# EAGLE design motor (EAGLE 6.6.0)
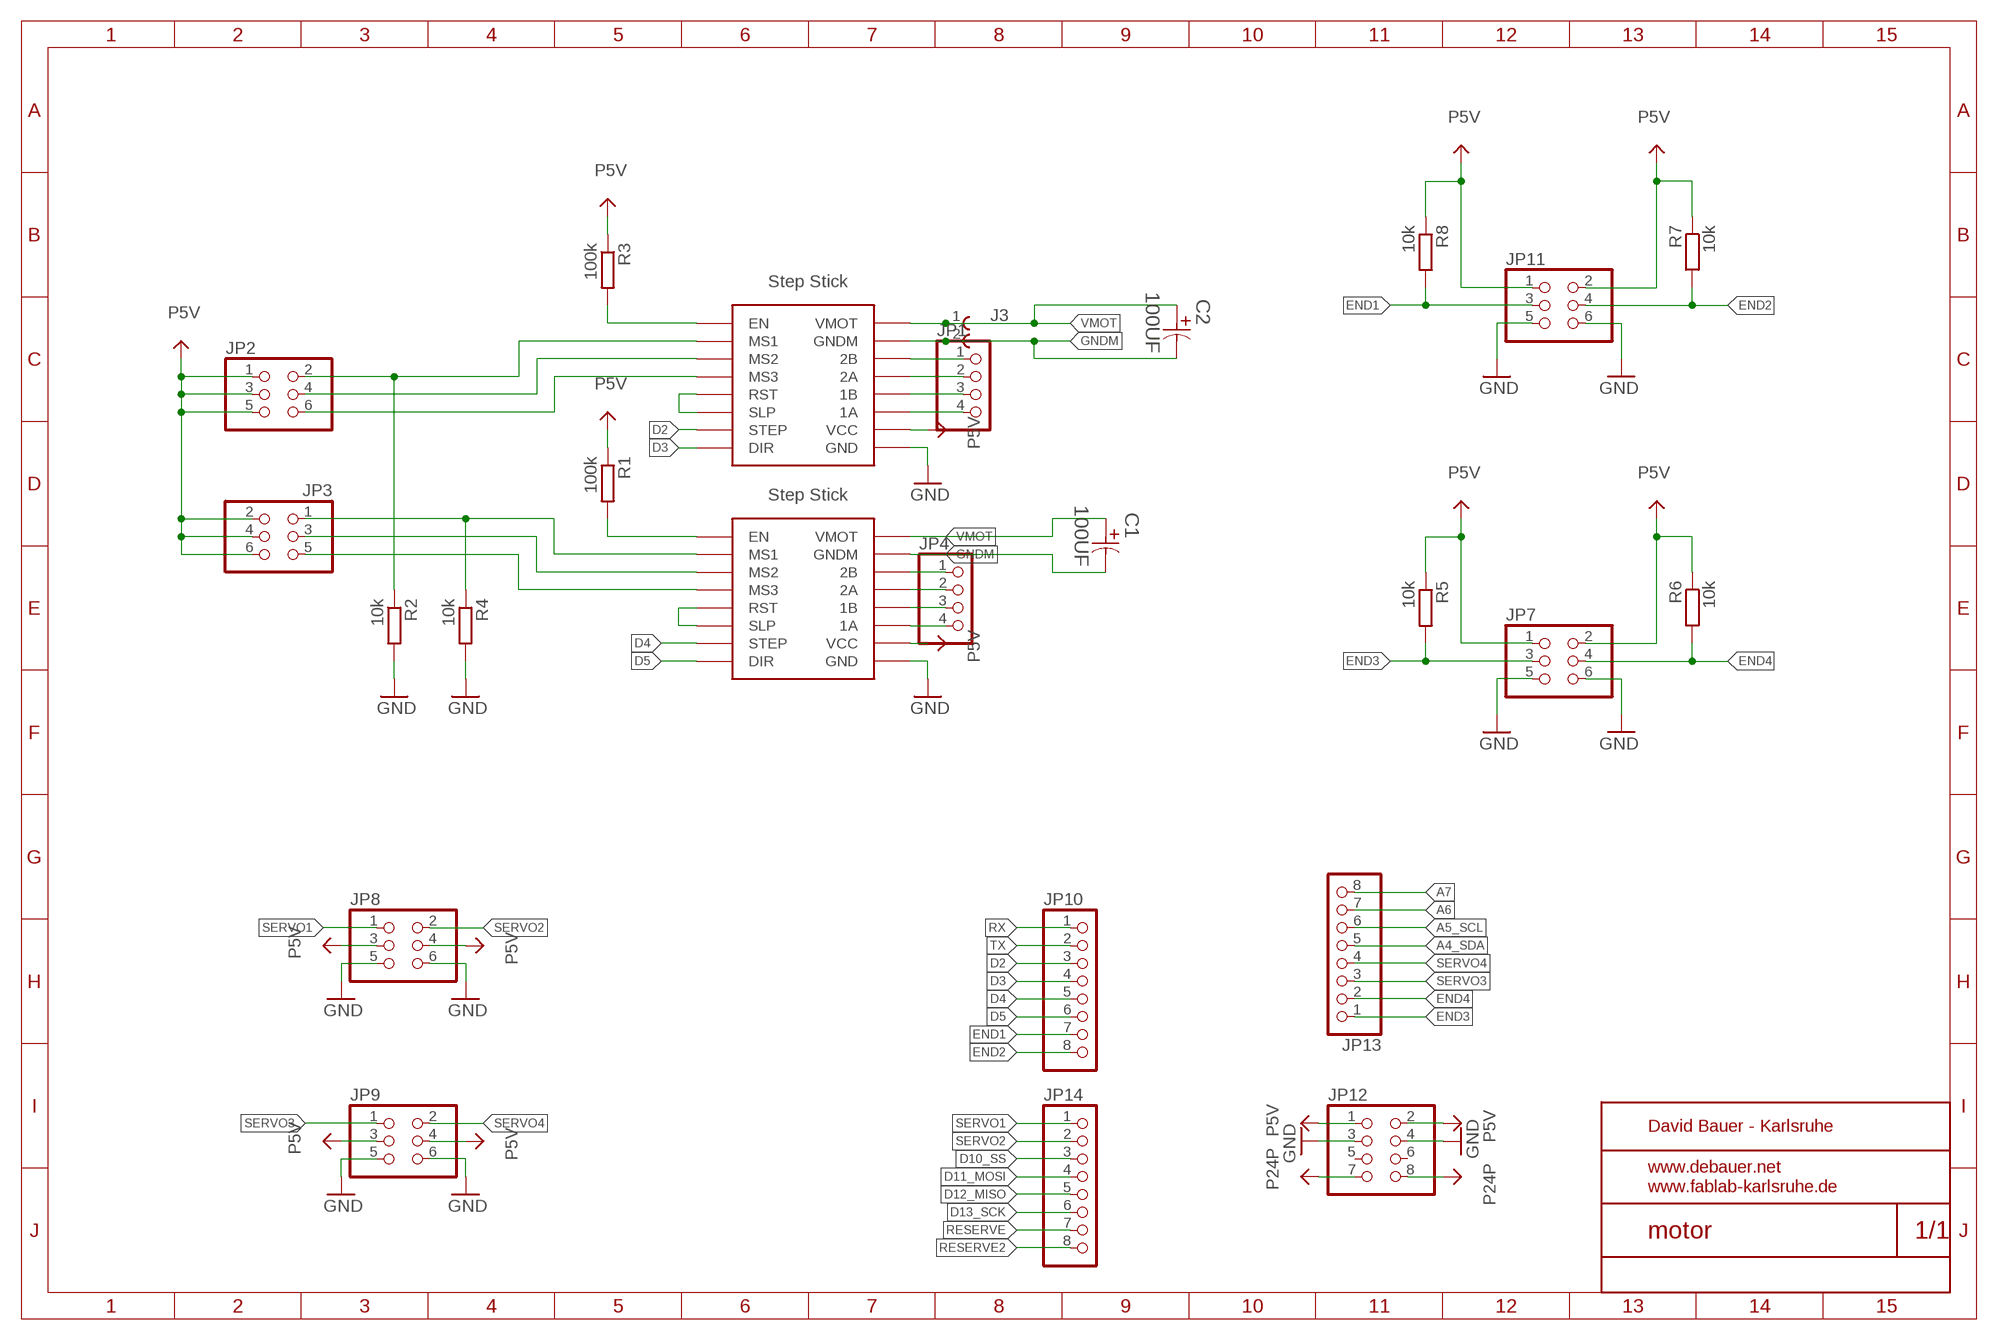
[diagram p0: schematic, sheet 1]

## Parts
C1  100UF  EEE-FK1V101P-CASE-F  [CAPAE830X1050N]
C2  100UF  EEE-FK1V101P-CASE-F  [CAPAE830X1050N]
J3  691312510002  [691312510002]
JP1  PINHD-1X4/90  [1X04/90]
JP2  PINHD-2X3  [2X03]
JP3  PINHD-2X3  [2X03]
JP4  PINHD-1X4/90  [1X04/90]
JP7  PINHD-2X3/90  [2X03/90]
JP8  PINHD-2X3/90  [2X03/90]
JP9  PINHD-2X3/90  [2X03/90]
JP10  PINHD-1X8  [1X08]
JP11  PINHD-2X3/90  [2X03/90]
JP12  PINHD-2X4  [2X04]
JP13  PINHD-1X8  [1X08]
JP14  PINHD-1X8  [1X08]
R1  100k  R-EU_R0805  [R0805]
R2  10k  R-EU_R0805  [R0805]
R3  100k  R-EU_R0805  [R0805]
R4  10k  R-EU_R0805  [R0805]
R5  10k  R-EU_R0805  [R0805]
R6  10k  R-EU_R0805  [R0805]
R7  10k  R-EU_R0805  [R0805]
R8  10k  R-EU_R0805  [R0805]
U$1  STEP-STICK  [STEP-STICK]
U$2  STEP-STICK  [STEP-STICK]

## Nets
A4_SDA: JP13.5
A5_SCL: JP13.6
A6: JP13.7
A7: JP13.8
D2: JP10.3 U$2.SPT(STEP)
D3: JP10.4 U$2.DIR
D4: JP10.5 U$1.SPT(STEP)
D5: JP10.6 U$1.DIR
D10_SS: JP14.3
D11_MOSI: JP14.4
D12_MISO: JP14.5
D13_SCK: JP14.6
END1: JP10.7 JP11.3 R8.2
END2: JP10.8 JP11.4 R7.2
END3: JP7.3 JP13.1 R5.2
END4: JP7.4 JP13.2 R6.2
GND: JP7.5 JP7.6 JP8.5 JP8.6 JP9.5 JP9.6 JP11.5 JP11.6 JP12.3 JP12.4 R2.2 R4.2 U$1.GND U$2.GND
GNDM: C1.2 C2.2 J3.2 U$1.GNDM U$2.GNDM
N$1: JP2.2 R2.1 U$2.MS1
N$2: JP2.4 U$2.MS2
N$3: JP2.6 U$2.MS3
N$4: JP3.1 R4.1 U$1.MS1
N$5: JP3.3 U$1.MS2
N$6: JP3.5 U$1.MS3
N$7: R1.2 U$1.EN
N$8: U$2.RST U$2.SLP
N$9: R3.2 U$2.EN
N$10: U$1.RST U$1.SLP
N$11: JP1.4 U$2.1A
N$12: JP1.3 U$2.1B
N$13: JP1.2 U$2.2A
N$14: JP1.1 U$2.2B
N$15: JP4.1 U$1.2B
N$16: JP4.2 U$1.2A
N$17: JP4.3 U$1.1B
N$18: JP4.4 U$1.1A
P5V: JP2.1 JP2.3 JP2.5 JP3.2 JP3.4 JP3.6 JP7.1 JP7.2 JP8.3 JP8.4 JP9.3 JP9.4 JP11.1 JP11.2 JP12.1 JP12.2 R1.1 R3.1 R5.1 R6.1 R7.1 R8.1 U$1.VCC U$2.VCC
P24P: JP12.7 JP12.8
RESERVE: JP14.7
RESERVE2: JP14.8
RX: JP10.1
SERVO1: JP8.1 JP14.1
SERVO2: JP8.2 JP14.2
SERVO3: JP9.1 JP13.3
SERVO4: JP9.2 JP13.4
TX: JP10.2
VMOT: C1.1 C2.1 J3.1 U$1.VMOT U$2.VMOT
Unconnected: JP12.5 JP12.6

## Library data of the parts
C1 C2 = PASSIV_Panasonic-EEEFK_EEEFP:EEE-: Aluminum Electrolytic Capacitors,Surface Mount Type; MPN: EEE-FK1V101P; OC_FARNELL: 9695869; OC_NEWARK: 82K7638; PACKAGE: CASE-F; SUPPLIER: PANASONIC; TOLERANCE: ±20 %; VOLTAGERATING: 35V
J3 = Eagle_TERMINAL_BLOCKS_rev16a:691312510002: WR-TBL Serie 312 - 5.08 mm Open Horizontal PCB Header , 2 Pins=>Code : Con_TBL_Pluggable_5.08_PCB_THT_Simple_H_691312510002 <http://katalog.we-online.de/media/images/eican/Con_TBL_Pluggable_5.08_PCB_THT_Simple_H_6913125100xx_pf2.jpg> Details see: http://katalog.we-online.de/en/em/691_312_510_0xx Created 2014-06-25, Karrer Zheng 2014 (C) Würth Elektronik
JP1 JP4 = pinhead:PINHD-1X4: PIN HEADER
JP2 JP3 JP7-JP9 JP11 = pinhead:PINHD-2X3: PIN HEADER
JP10 JP13 JP14 = pinhead:PINHD-1X8: PIN HEADER
JP12 = pinhead:PINHD-2X4: PIN HEADER
R1-R8 = schlager_passiv:R-EU_: RESISTOR, European symbol
U$1 U$2 = Arduino-clone:STEP-STICK

## Net classes
4 USBpair: width 0.254 mm, drill 0.406 mm, clearance 0.508 mm

## Board
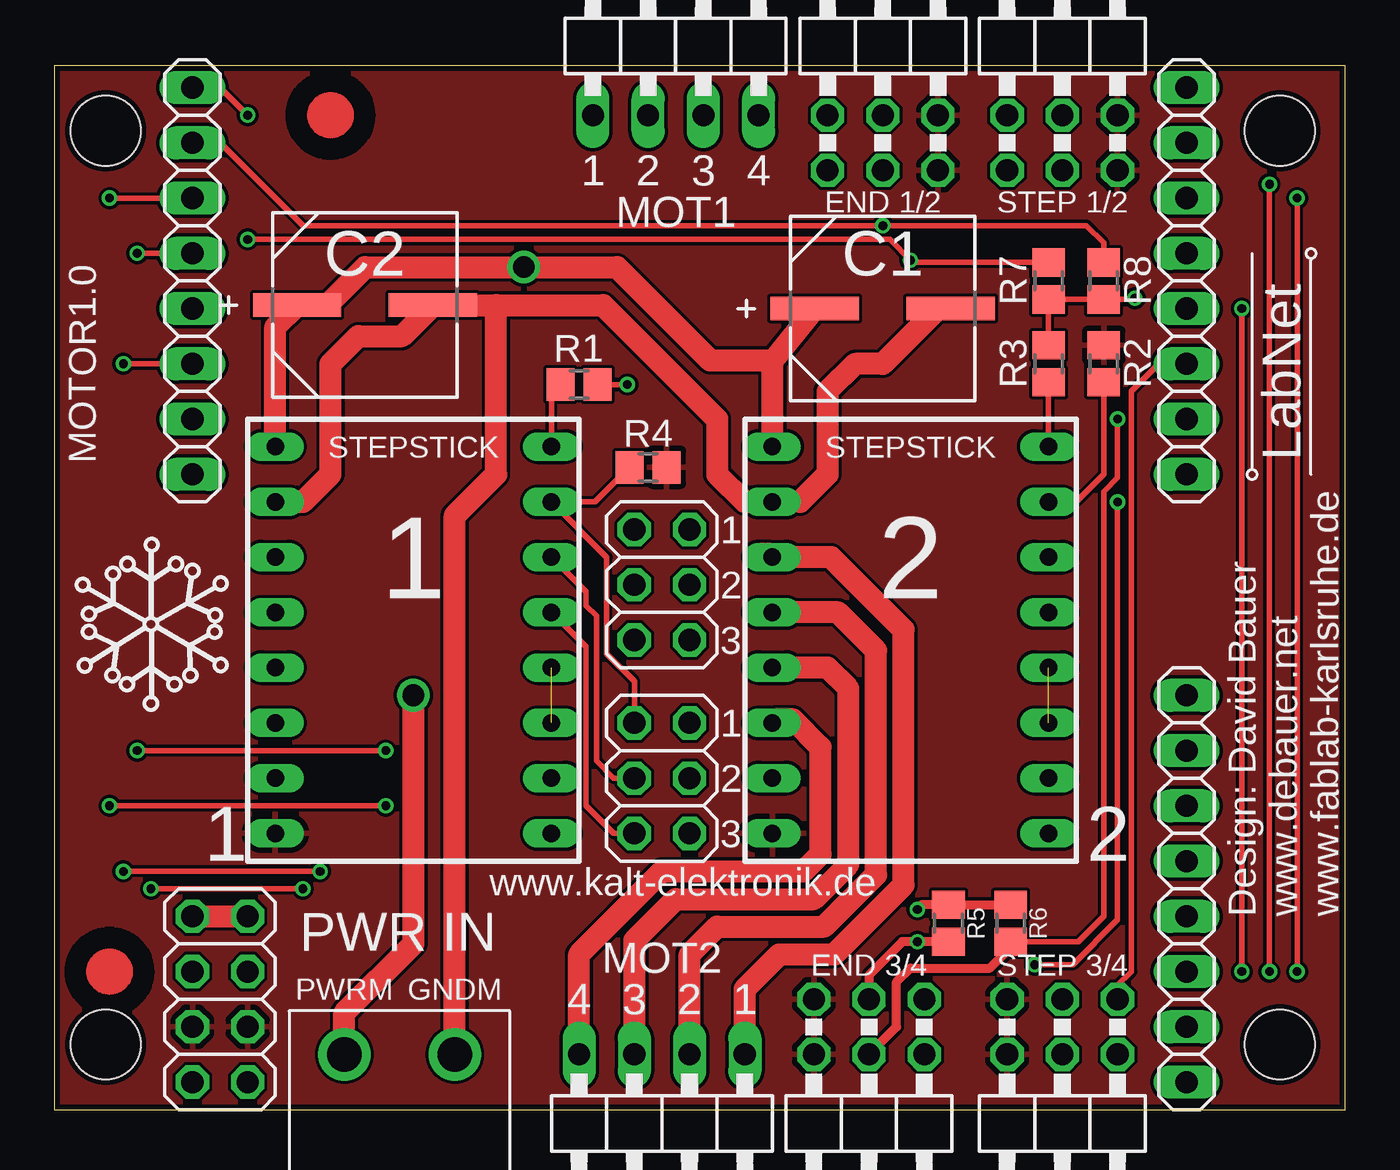
[diagram p1: board, top side]
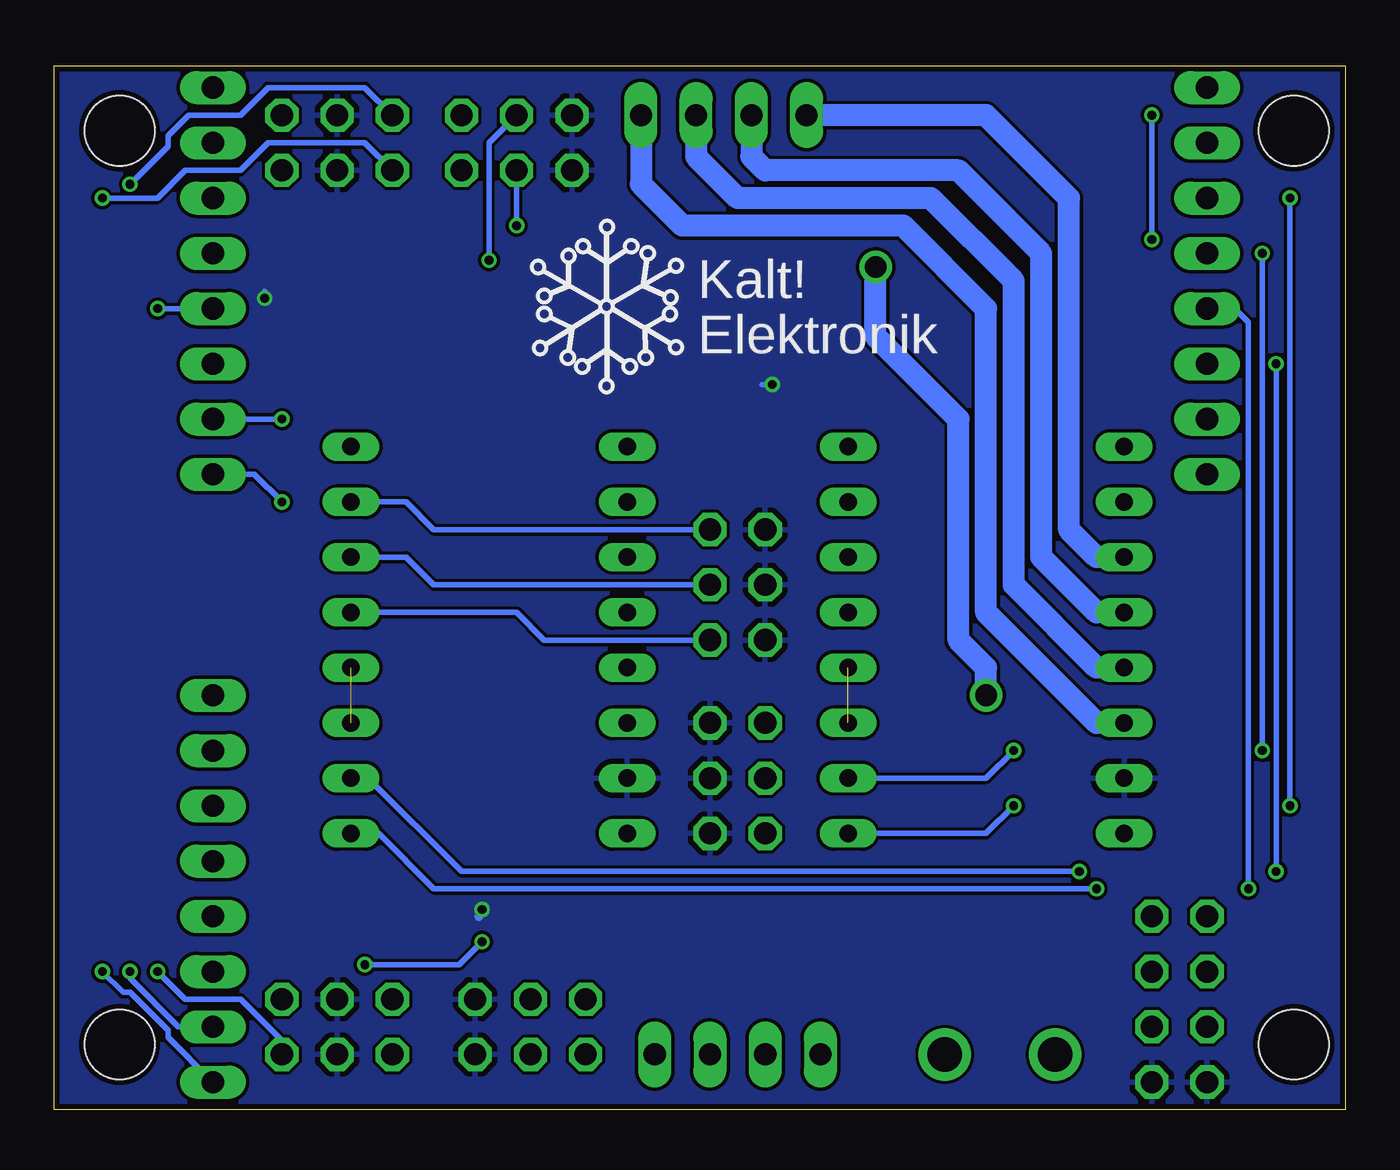
[diagram p2: board, bottom side, seen from below]

Size 59.36 x 48 mm. Coordinates in mm from the lower left corner, seen from the top.
Outline: 0,0 59.36,0 59.36,48 0,48 0,0
Copper layers (1*16): Top 0.035mm / dielectric 1.5mm / Bottom 0.035mm
Design rules "ITEADstudio_DRC": minimum track width 6mil, minimum drill 12mil, track to track 6mil, track to pad 6mil, pad to pad 6mil, via to via 6mil, smd to smd 0mil, copper to edge 10mil, drill to drill 10mil, minimum pad ring 10mil, minimum via ring 6mil, stop-mask expansion 2mil, vias tented up to drill 100mil, thermal gap 10mil
Holes 3.2 mm at 56.36,45 56.36,3 2.36,45 2.36,3

### Footprints (pad centres in the part's own frame; a part is rotated, then mirrored left to right if it is on the bottom)
CAPAE830X1050N = smd 4.064 x 1.092: 1 -3.124,0; 2 3.124,0
691312510002 = drill 1.6: 1 -5.08,0; 2 0,0
1X04/90 = drill 1.016 long: 1 -3.81,-3.81; 2 -1.27,-3.81; 3 1.27,-3.81; 4 3.81,-3.81
2X03 = drill 1.016 octagon: 1 -2.54,-1.27; 2 -2.54,1.27; 3 0,-1.27; 4 0,1.27; 5 2.54,-1.27; 6 2.54,1.27
2X03/90 = drill 1.016 octagon: 1 -2.54,-6.35; 2 -2.54,-3.81; 3 0,-6.35; 4 0,-3.81; 5 2.54,-6.35; 6 2.54,-3.81
1X08 = drill 1.016 long: 1 -8.89,0; 2 -6.35,0; 3 -3.81,0; 4 -1.27,0; 5 1.27,0; 6 3.81,0; 7 6.35,0; 8 8.89,0
2X04 = drill 1.016 octagon: 1 -3.81,-1.27; 2 -3.81,1.27; 3 -1.27,-1.27; 4 -1.27,1.27; 5 1.27,-1.27; 6 1.27,1.27; 7 3.81,-1.27; 8 3.81,1.27
R0805 = smd 1.3 x 1.5: 1 -0.85,0; 2 0.85,0
STEP-STICK = drill 0.8 long: 1A -8.89,-7.62; 1B -8.89,-5.08; 2A -8.89,-2.54; 2B -8.89,0; DIR 3.81,-12.7; EN 3.81,5.08; GND -8.89,-12.7; GNDM -8.89,2.54; MS1 3.81,2.54; MS2 3.81,0; MS3 3.81,-2.54; RST 3.81,-5.08; SLP 3.81,-7.62; SPT 3.81,-10.16; VCC -8.89,-10.16; VMOT -8.89,5.08

### Placement (x,y rotation side)
C1  38.1,36.83 0 top
C2  14.29,36.99 0 top
J3  18.41,2.54 0 top
JP1  27.94,-1.27 180 top
JP2  27.94,24.13 270 top
JP3  27.94,15.24 270 top
JP4  28.58,49.53 0 top
JP7  37.47,-1.27 180 top
JP8  46.36,49.53 0 top
JP9  46.36,-1.27 180 top
JP10  6.35,38.1 90 top
JP11  38.1,49.53 0 top
JP12  7.62,5.08 90 top
JP13  52.07,38.1 90 top
JP14  52.07,10.16 90 top
R1  24.13,33.34 180 top
R2  48.26,34.29 90 top
R3  45.72,34.29 270 top
R4  27.3,29.53 0 top
R5  41.12,8.57 270 top
R6  43.97,8.57 270 top
R7  45.72,38.1 90 top
R8  48.26,38.1 90 top
U$1  19.05,25.4 0 top
U$2  41.91,25.4 0 top
U$3  [PASSMARK]  12.7,45.72 0 top
U$4  [SNOW]  4.45,22.7 0 top
U$6  [KALT!ELEKTRONIK]  26.67,36.83 0 bottom
U$7  [LABNET]  57.15,34.29 90 top
U$8  [PASSMARK]  2.54,6.35 0 top

### Tracks (layer width: path | path; a pad name or v marks a point on that pad's centre or on a via)
D2  (via drill 0.4)
  Top 0.254: v12.22,10.95 v3.17,10.95 | v3.17,34.29 JP10.3
  Bottom 0.254: U$2.SPT 44.93,15.24 40.64,10.95 v12.22,10.95 | v3.17,10.95 v3.17,34.29
D3  (via drill 0.4)
  Top 0.254: v11.43,10.16 v4.45,10.16
  Bottom 0.254: U$2.DIR 44.45,12.7 41.91,10.16 v11.43,10.16 | v4.45,10.16 4.45,36.2 5.08,36.83 JP10.4
D4  (via drill 0.4)
  Top 0.254: v3.81,16.51 12.7,16.51 v15.24,16.51 | v3.81,39.37 JP10.5
  Bottom 0.254: v3.81,16.51 v3.81,39.37 | U$1.SPT 16.51,15.24 v15.24,16.51
D5  (via drill 0.4)
  Top 0.254: v2.54,41.91 JP10.6 | v15.24,13.97 v2.54,13.97
  Bottom 0.254: v2.54,13.97 v2.54,41.91 | U$1.DIR 16.51,12.7 v15.24,13.97
END1  (via drill 0.4)
  Top 0.254: R8.2 48.26,39.85 47.47,40.64 v38.1,40.64 11.43,40.64 7.62,44.45 JP10.7
  Bottom 0.254: v38.1,40.64 JP11.3
END2  (via drill 0.4)
  Top 0.254: R7.2 39.47,38.95 v39.37,39.05 38.42,40.01 v8.89,40.01 | JP10.8 7.62,46.99 v8.89,45.72
  Bottom 0.254: v39.37,39.05 39.37,44.45 JP11.4 | v8.89,45.72 v8.89,40.01
END3  (via drill 0.4)
  Top 0.254: v48.89,27.94 48.89,8.73 46.83,6.67 v45.08,6.67
  Top 0.406: JP7.3 37.47,6.19 39,7.72 v39.69,7.72 R5.2
  Bottom 0.254: JP13.1 50.17,29.21 v48.89,27.94 | v45.08,6.67 40.74,6.67 v39.69,7.72
END4  (via drill 0.4)
  Top 0.254: R6.2 47.09,7.72 48.26,8.89 48.26,28.42 48.89,29.05 v48.89,31.75
  Top 0.406: JP7.4 38.73,3.81 38.73,5.87 39.37,6.51 43.02,6.51 43.66,7.14 R6.2
  Bottom 0.254: v48.89,31.75 JP13.2
GND
  pour Top (rank 5): -84.3,68.58 96.52,68.58 96.52,-13.97 -83.34,-13.81
GNDM
  Top 1.016: C1.2 40.64,36.83 38.1,34.29 36.83,34.29 35.56,33.02 35.56,29.21 34.29,27.94 U$2.GNDM 31.75,27.94 30.48,29.21 30.48,31.75 25.24,36.99 20.32,36.99 | U$1.GNDM 11.43,27.94 12.7,29.21 12.7,34.29 13.97,35.56 15.98,35.56 C2.2 20.32,36.99 | J3.2 18.41,27.3 20.32,29.21 20.32,36.99
N$1
  Top 0.254: R2.1 48.26,29.21 46.99,27.94 U$2.MS1
  Bottom 0.254: U$2.MS1 43.18,27.94 41.91,26.67 JP2.2
N$2
  Bottom 0.254: U$2.MS2 43.18,25.4 41.91,24.13 JP2.4
N$3
  Bottom 0.254: U$2.MS3 38.1,22.86 36.83,21.59 JP2.6
N$4
  Top 0.254: JP3.1 26.67,19.68 25.4,20.95 25.4,25.4 U$1.MS1 24.87,27.94 R4.1
N$5
  Top 0.254: JP3.3 25.72,15.24 24.92,16.03 24.92,22.7 24.45,23.18 24.45,23.81 U$1.MS2
N$6
  Top 0.254: JP3.5 25.72,12.7 24.45,13.97 24.45,21.27 U$1.MS3
N$7
  Top 0.254: U$1.EN 22.86,32.92 R1.2
N$8  (1 unrouted)
N$9
  Top 0.254: R3.2 U$2.EN
N$10  (1 unrouted)
N$11
  Top 1.016: JP1.4 24.13,7.14 27.94,10.95 34.45,10.95 35.24,11.75 35.24,16.67 33.97,17.94 33.18,17.94 U$2.1A
N$12
  Top 1.016: JP1.3 26.67,7.78 28.58,9.68 34.92,9.68 36.51,11.27 36.51,19.37 35.56,20.32 U$2.1B
N$13
  Top 1.016: JP1.2 29.21,7.14 30.48,8.41 35.4,8.41 37.78,10.79 37.78,21.11 36.04,22.86 U$2.2A
N$14
  Top 1.016: JP1.1 31.75,5.56 33.34,7.14 35.88,7.14 39.05,10.32 39.05,22.07 35.72,25.4 U$2.2B | U$2.2B 32.7,25.4 32.54,25.56 32.86,25.56 U$2.2B
N$15
  Bottom 1.016: U$1.2B 11.43,25.4 12.7,26.67 12.7,41.91 16.51,45.72 JP4.1
N$16
  Bottom 1.016: U$1.2A 11.43,22.86 13.97,25.4 13.97,39.37 17.78,43.18 26.67,43.18 27.3,43.81 JP4.2
N$17
  Bottom 1.016: U$1.1B 11.43,20.32 15.24,24.13 15.24,38.1 19.05,41.91 27.94,41.91 29.84,43.81 JP4.3
N$18
  Bottom 1.016: U$1.1A 11.43,17.78 16.51,22.86 16.51,36.83 20.32,40.64 30.48,40.64 32.39,42.55 JP4.4
P5V  (via drill 0.4)
  Top 0.254: R3.1 R7.1 | R7.1 R8.1 | R1.1 v26.35,33.34 | R7.1 49.63,37.25 v49.69,37.31
  Top 0.406: R6.1 R5.1 39.9,9.42 v39.69,9.21
  Bottom 0.254: v26.35,33.34 26.83,33.34 | v49.69,37.31 49.69,37.62
  Bottom 0.406: v39.69,9.21 39.85,8.89
  pour Bottom: -91.44,71.12 99.06,71.12 99.06,-15.24 -91.44,-15.24
P24P
  Top 1.016: JP12.8 JP12.7
SERVO1  (via drill 0.4)
  Top 0.254: v57.15,6.35 v57.15,41.91
  Bottom 0.254: JP14.1 54.13,3.33 54.13,3.65 55.88,5.4 56.2,5.4 v57.15,6.35 | v57.15,41.91 54.61,41.91 53.34,43.18 50.8,43.18 49.53,44.45 45.08,44.45 JP8.1
SERVO2  (via drill 0.4)
  Top 0.254: v55.88,6.35 v55.88,42.55
  Bottom 0.254: JP14.2 53.66,3.81 55.88,6.03 v55.88,6.35 | v55.88,42.55 54.13,44.29 54.13,44.77 53.18,45.72 50.8,45.72 49.53,46.99 45.08,46.99 JP8.2
SERVO3
  Top 0.254: JP9.1 48.89,5.71 49.53,6.35 49.53,33.02 50.8,34.29 JP13.3
SERVO4  (via drill 0.4)
  Top 0.254: v54.61,6.35 v54.61,36.83
  Bottom 0.254: JP9.2 48.89,3.17 50.8,5.08 53.34,5.08 v54.61,6.35 | v54.61,36.83 JP13.4
VMOT  (via drill 1)
  Top 1.016: U$1.VMOT 10.16,35.98 C2.1 12.54,36.99 14.29,38.73 v21.59,38.73 25.88,38.73 30.16,34.45 32.97,34.45 33.02,34.4 | U$2.VMOT 33.02,34.4 | 33.02,34.4 C1.1 | J3.1 13.34,4.45 16.51,7.62 v16.51,19.05
  Bottom 1.016: v16.51,19.05 16.51,20.32 17.78,21.59 17.78,31.75 21.59,35.56 v21.59,38.73

### Text on the board
tPlace: MOTOR1.0 | www.kalt-elektronik.de | Design: David Bauer | www.debauer.net | www.fablab-karlsruhe.de | PWR IN
tNames: 1 | 2 | 3 | 4 | END 1/2 | STEP 1/2 | MOT1 | STEPSTICK | STEPSTICK | 1 | 1 | 2 | 2 | 3 | 1 | 2 | 1 | 3 | 2 | MOT2 | END 3/4 | STEP 3/4 | PWRM | GNDM | 4 | 3 | 2 | 1